# Altium project DA2.PrjPcb (part 1 of 2)
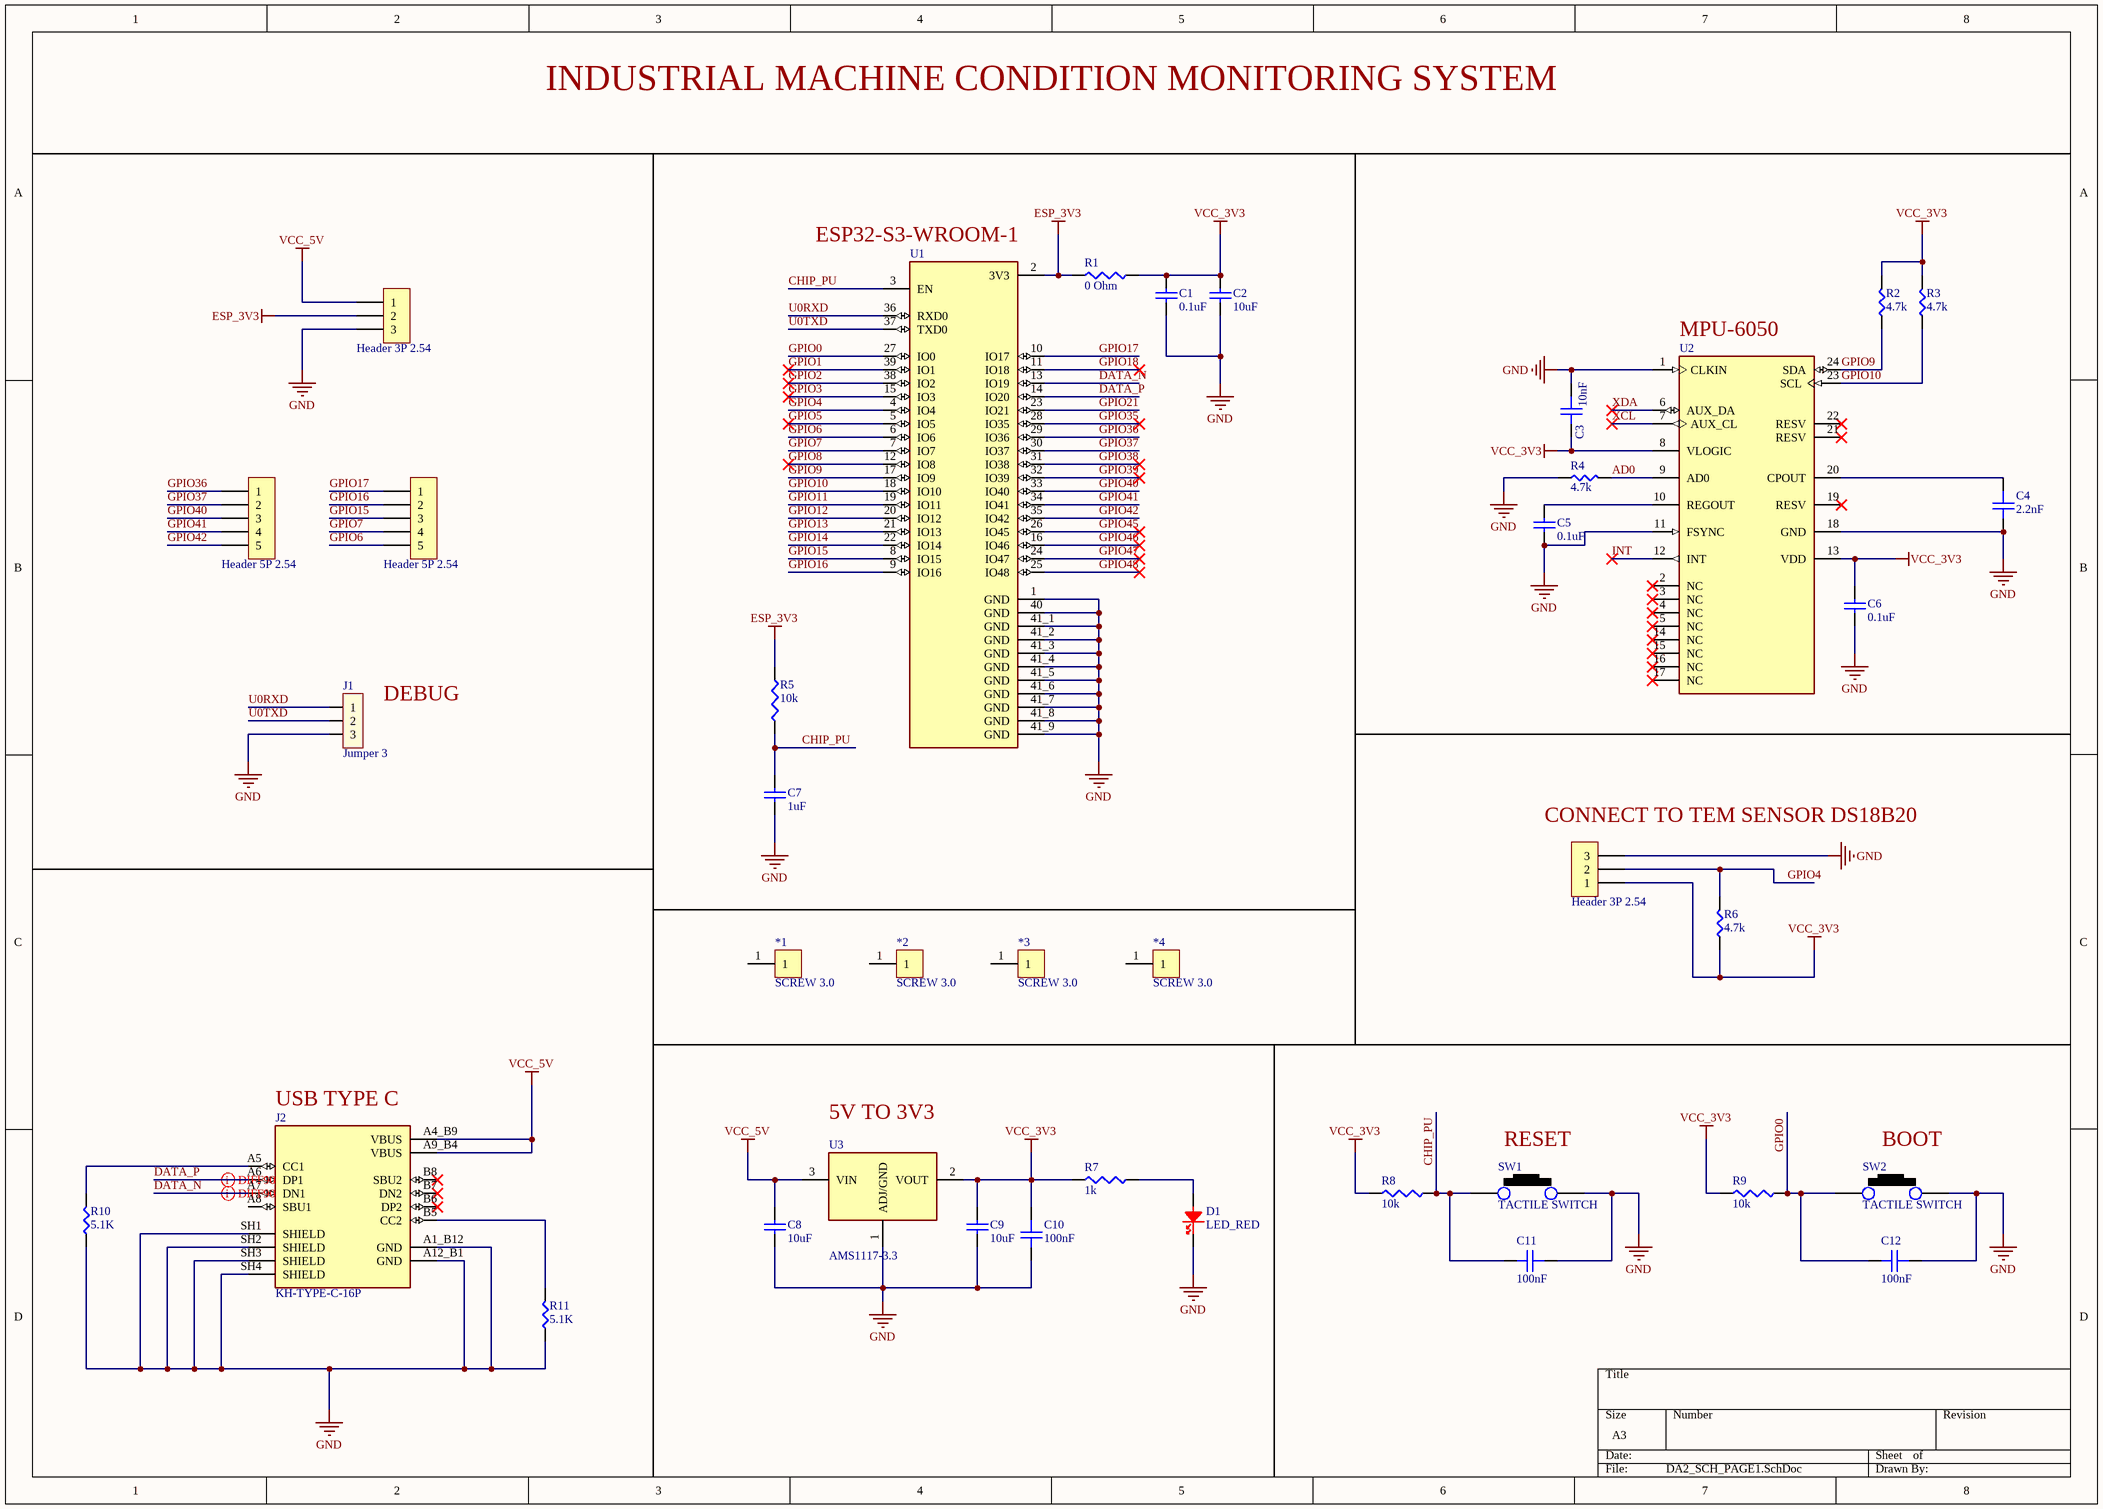
[diagram p0: DA2_SCH_PAGE1.SchDoc]
2 sheets, 68 parts. Net scope: global (net labels, ports and power ports of the same name join across sheets).
Board file: DA2_VERR2_PCB.PcbDoc
Sheets:
  DA2_SCH_PAGE1.SchDoc
  DA2_SCH_PAGE2.SchDoc

## Sheet DA2_SCH_PAGE1.SchDoc
size A3; SheetNumber: 1; SheetTotal: 2

### Parts
*1  SCREW 3.0  [Screw 3.0 v2]
*2  SCREW 3.0  [Screw 3.0 v2]
*3  SCREW 3.0  [Screw 3.0 v2]
*4  SCREW 3.0  [Screw 3.0 v2]
C1  0.1uF  [Tu 0805]
C2  10uF  [Tu 0805]
C3  10nF  [tu 0805]
C4  2.2nF  [tu 0805]
C5  0.1uF  [Tu 0805]
C6  0.1uF  [Tu 0805]
C7  1uF  [Tu 0805]
C8  10uF  [Tu 0805]
C9  10uF  [Tu 0805]
C10  100nF  [tu 0805]
C11  100nF  [tu 0805]
C12  100nF  [tu 0805]
D1  LED_RED  [LED 0805]
H1  Header 3P 2.54  [XH2.54M-3]
H2  Header 5P 2.54  [XH2.54M-5]
H3  Header 5P 2.54  [XH2.54M-5]
H4  Header 3P 2.54  [XH2.54M-3]
J1  Jumper 3  [JP3]
J2  KH-TYPE-C-16P  [KINGHELM_KH-TYPE-C-16P]
R1  0 Ohm  [Tro SMD 0805]
R2  4.7k  [tro smd 0805]
R3  4.7k  [tro smd 0805]
R4  4.7k  [tro smd 0805]
R5  10k  [Tro SMD 0805]
R6  4.7k  [tro smd 0805]
R7  1k  [Tro SMD 0805]
R8  10k  [Tro SMD 0805]
R9  10k  [Tro SMD 0805]
R10  5.1K  [tro smd 0805]
R11  5.1K  [tro smd 0805]
SW1  TACTILE SWITCH  [SWITCH SMD]
SW2  TACTILE SWITCH  [SWITCH SMD]
U1  ESP32-S3-WROOM-1-N8R2  [XCVR_ESP32-S3-WROOM-1-N8R2]  (value not drawn)
U2  MPU-6050  [QFN50P400X400X95-24N]  (value not drawn)
U3  AMS1117-3.3  [SOT229P700X180-4N]

### Nets
ESP_3V3: H1.2 R1.1 R5.2 U1.2(3V3)
GND: C1.1 C2.1 C3.1 C4.2 C5.1 C6.1 C7.1 C8.1 C9.1 C10.2 C11.1 C12.1 D1.1 H1.3 H4.3 J1.3 J2.A1_B12(GND) J2.A12_B1(GND) J2.SH1(SHIELD) J2.SH2(SHIELD) J2.SH3(SHIELD) J2.SH4(SHIELD) R4.1 R10.1 R11.1 SW1.2 SW2.2 U1.1(GND) U1.40(GND) U1.41_1(GND) U1.41_2(GND) U1.41_3(GND) U1.41_4(GND) U1.41_5(GND) U1.41_6(GND) U1.41_7(GND) U1.41_8(GND) U1.41_9(GND) U2.1(CLKIN) U2.11(FSYNC) U2.18(GND) U3.1(ADJ/GND)
VCC_3V3: C1.2 C2.2 C3.2 C6.2 C9.2 C10.1 H4.1 R1.2 R2.2 R3.2 R6.1 R7.1 R8.1 R9.1 U2.8(VLOGIC) U2.13(VDD) U3.2(VOUT)
VCC_5V: C8.2 H1.1 J2.A4_B9(VBUS) J2.A9_B4(VBUS) U3.3(VIN)
AD0: R4.2 U2.9(AD0)
CHIP_PU: C7.2 C11.2 R5.1 R8.2 SW1.1 U1.3(EN)
DATA_N: J2.A7(DN1) U1.13(IO19)
DATA_P: J2.A6(DP1) U1.14(IO20)
GPIO0: C12.2 R9.2 SW2.1 U1.27(IO0)
GPIO1: U1.39(IO1)
GPIO2: U1.38(IO2)
GPIO3: U1.15(IO3)
GPIO4: H4.2 R6.2 U1.4(IO4)
GPIO5: U1.5(IO5)
GPIO6: H3.5 U1.6(IO6)
GPIO7: H3.4 U1.7(IO7)
GPIO8: U1.12(IO8)
GPIO9: R2.1 U1.17(IO9) U2.24(SDA)
GPIO10: R3.1 U1.18(IO10) U2.23(SCL)
GPIO11: U1.19(IO11)
GPIO12: U1.20(IO12)
GPIO13: U1.21(IO13)
GPIO14: U1.22(IO14)
GPIO15: H3.3 U1.8(IO15)
GPIO16: H3.2 U1.9(IO16)
GPIO17: H3.1 U1.10(IO17)
GPIO18: U1.11(IO18)
GPIO21: U1.23(IO21)
GPIO35: U1.28(IO35)
GPIO36: H2.1 U1.29(IO36)
GPIO37: H2.2 U1.30(IO37)
GPIO38: U1.31(IO38)
GPIO39: U1.32(IO39)
GPIO40: H2.3 U1.33(IO40)
GPIO41: H2.4 U1.34(IO41)
GPIO42: H2.5 U1.35(IO42)
GPIO45: U1.26(IO45)
GPIO46: U1.16(IO46)
GPIO47: U1.24(IO47)
GPIO48: U1.25(IO48)
INT: U2.12(INT)
U0RXD: J1.1 U1.36(RXD0)
U0TXD: J1.2 U1.37(TXD0)
XCL: U2.7(AUX_CL)
XDA: U2.6(AUX_DA)
NetC4_1: C4.1 U2.20(CPOUT)
NetC5_2: C5.2 U2.10(REGOUT)
NetD1_2: D1.2 R7.2
NetJ2_A5: J2.A5(CC1) R10.2
NetJ2_B5: J2.B5(CC2) R11.2

Not connected (* = marked no-connect by the designer): *1 1; *2 1; *3 1; *4 1; J2 A8(SBU1) B6(DP2)* B7(DN2)* B8(SBU2)*; U2 2(NC)* 3(NC)* 4(NC)* 5(NC)* 14(NC)* 15(NC)* 16(NC)* 17(NC)* 19(RESV)* 21(RESV)* 22(RESV)*

### Layout directives
differential pair; differential pair class diff90: DATA_N, DATA_P

### Notes on the sheet
- INDUSTRIAL MACHINE CONDITION MONITORING SYSTEM
- (near U1) ESP32-S3-WROOM-1
- (near U2) MPU-6050
- (near J1) DEBUG
- (near H4) CONNECT TO TEM SENSOR DS18B20
- (near J2) USB TYPE C
- 5V TO 3V3
- (near SW1) RESET
- (near SW2) BOOT

### Library data of the parts
C1 C5 C6 = Tu 0.1uF: Dán 0805; Manufacturer: Samsung Electro-Mechanics; Manufacturer Part Number: CL05B104KB5NNWC; Value: 100nF; Dielectric Material: Ceramic; Voltage Rating (DC): 50V; Supplier: DigiKey; Supplier Part Number: 1276-CL05B104KB5NNWCCT-ND; RoHS: Compliant; Category: Ceramic Capacitors; Stock: 89504; Pricing: 1=0.1, 10=0.054, 50=0.037, 100=0.0319, 500=0.02338, 1000=0.02075, 2500=0.018, 5000=0.01634 (USD); China RoHS: Compliant; Lifecycle Status: Production; Max Operating Temperature: 125°C; Min Operating Temperature: -55°C; Mounting Technology: Surface Mount; Number of Terminals: 2; REACH SVHC: Yes; Schedule B: 8532240020, 8532240020|8532240020|8532240020|8532240020|8532240020; ComponentLink1URL: https://datasheet.octopart.com:443/CL05B104KB5NNWC-Samsung-Electro-Mechanics-datasheet-182018729.pdf?src-supplier=IHS; ComponentLink1Description: https://datasheet.octopart.com:443/CL05B104KB5NNWC-Samsung-Electro-Mechanics-datasheet-182018729.pdf?src-supplier=IHS; LCSC Part Number: C7229230
C2 C8 C9 = Tu 10uF: Dán 0805; Manufacturer: Samsung Electro-Mechanics; Manufacturer Part Number: CL05A106MP5NUNC; Value: 10µF; Dielectric: X5R; Dielectric Material: Ceramic; Tolerance: 20%; Voltage Rating: 10V; Supplier: DigiKey; Supplier Part Number: 1276-1450-1-ND; RoHS: Compliant; Category: Ceramic Capacitors; Stock: 2239957; Pricing: 1=0.08, 10=0.038, 50=0.034, 100=0.0296, 500=0.0272, 1000=0.02, 2500=0.01844 (USD); Case/Package: 0402; Case Code (Imperial): 0402; Case Code (Metric): 1005; China RoHS: Compliant; Contact Plating: Tin; Depth: 500µm; Height: 700µm; Lead Free: Lead Free; Length: 1mm; Lifecycle Status: NRND; Material: Ceramic; Max Operating Temperature: 85°C; Min Operating Temperature: -55°C; Mounting Technology: Surface Mount; Number of Terminals: 2; Packaging: Tape and Reel; Radiation Hardening: No; REACH SVHC: Yes; Schedule B: 8532240020, 8532240020|8532240020|8532240020|8532240020|8532240020|8532240020|8532240020|8532240020|8532240020|8532240020|8532240020|8532240020|8532240020|8532240020|8532240020|8532240020|8532240020|8532240020|8532240020|8532240020|8532240020|8532240020|8532240020|85; Termination: Wraparound; Thickness: 711.2µm; Voltage Rating (DC): 10V; Width: 500µm; ComponentLink1URL: https://datasheet.octopart.com:443/CL05A106MP5NUNC-Samsung-Electro-Mechanics-datasheet-182018593.pdf?src-supplier=IHS; ComponentLink1Description: https://datasheet.octopart.com:443/CL05A106MP5NUNC-Samsung-Electro-Mechanics-datasheet-182018593.pdf?src-supplier=IHS; ComponentLink2URL: https://datasheet.octopart.com:443/CL05A106MP5NUNC-Samsung-Electro-Mechanics-datasheet-136031723.pdf?src-supplier=Upverter; ComponentLink2Description: https://datasheet.octopart.com:443/CL05A106MP5NUNC-Samsung-Electro-Mechanics-datasheet-136031723.pdf?src-supplier=Upverter; ComponentLink3URL: https://datasheet.octopart.com:443/CL05A106MP5NUNC-Samsung-Electro-Mechanics-datasheet-110226206.pdf?src-supplier=Future+Electronics; ComponentLink3Description: https://datasheet.octopart.com:443/CL05A106MP5NUNC-Samsung-Electro-Mechanics-datasheet-110226206.pdf?src-supplier=Future+Electronics; ComponentLink4URL: https://datasheet.octopart.com:443/CL05A106MP5NUNC-Samsung-Electro-Mechanics-datasheet-87580039.pdf?src-supplier=Future+Electronics; ComponentLink4Description: https://datasheet.octopart.com:443/CL05A106MP5NUNC-Samsung-Electro-Mechanics-datasheet-87580039.pdf?src-supplier=Future+Electronics; ComponentLink5URL: https://datasheet.octopart.com:443/CL05A106MP5NUNC-Samsung-Electro-Mechanics-datasheet-81461595.pdf?src-supplier=Future+Electronics; ComponentLink5Description: https://datasheet.octopart.com:443/CL05A106MP5NUNC-Samsung-Electro-Mechanics-datasheet-81461595.pdf?src-supplier=Future+Electronics; ComponentLink6URL: https://datasheet.octopart.com:443/CL05A106MP5NUNC-Samsung-datasheet-42280527.pdf?src-supplier=Future+Electronics; ComponentLink6Description: https://datasheet.octopart.com:443/CL05A106MP5NUNC-Samsung-datasheet-42280527.pdf?src-supplier=Future+Electronics; ComponentLink7URL: https://datasheet.octopart.com:443/CL05A106MP5NUNC-Samsung-datasheet-34153002.pdf?src-supplier=Future+Electronics; ComponentLink7Description: https://datasheet.octopart.com:443/CL05A106MP5NUNC-Samsung-datasheet-34153002.pdf?src-supplier=Future+Electronics; ComponentLink8URL: https://datasheet.octopart.com:443/CL05A106MP5NUNC-Samsung-datasheet-25077983.pdf?src-supplier=Future+Electronics; ComponentLink8Description: https://datasheet.octopart.com:443/CL05A106MP5NUNC-Samsung-datasheet-25077983.pdf?src-supplier=Future+Electronics; ComponentLink9URL: https://datasheet.octopart.com:443/CL05A106MP5NUNC-Samsung-Electro-Mechanics-datasheet-149136670.pdf?src-supplier=Future+Electronics; ComponentLink9Description: https://datasheet.octopart.com:443/CL05A106MP5NUNC-Samsung-Electro-Mechanics-datasheet-149136670.pdf?src-supplier=Future+Electronics; ComponentLink10URL: https://datasheet.octopart.com:443/CL05A106MP5NUNC-Samsung-datasheet-8326407.pdf?src-supplier=TME; ComponentLink10Description: https://datasheet.octopart.com:443/CL05A106MP5NUNC-Samsung-datasheet-8326407.pdf?src-supplier=TME; LCSC Part Number: C315248
C3 = Tu 10nF: Dán 0805; Don_Vi: Con; So_Chan: 2; Ten_Linh_Kien: Tụ 0805 22nF 50V 20%; Ma_Hang: MH007857; Chung_Loai: Dán; Kieu_Chan: *
C4 = Tu 2.2nF: Dán 0805; Don_Vi: Con; So_Chan: 2; Ten_Linh_Kien: Tụ 0805 22nF 50V 20%; Ma_Hang: MH007857; Chung_Loai: Dán; Kieu_Chan: *
C7 = Tu 1uF: Dán 0805; Manufacturer: Murata; Manufacturer Part Number: GRM155R6YA105KE11D; Manufacturer Lifecycle Status: IN PRODUCTION; Value: 1µF; Dielectric: X5R; Dielectric Material: Ceramic; Tolerance: 10%; Voltage Rating: 35V; Supplier: DigiKey; Supplier Part Number: 490-10019-1-ND; RoHS: Compliant; Category: Ceramic Capacitors; Stock: 212803; Pricing: 1=0.1, 10=0.048, 50=0.033, 100=0.0284, 500=0.01904, 1000=0.01691, 2500=0.01582, 5000=0.01432 (USD); Case/Package: 0402; Case Code (Imperial): 0402; Case Code (Metric): 1005; Height: 500µm; Length: 1mm; Lifecycle Status: Production; Material: Ceramic; Max Operating Temperature: 85°C; Min Operating Temperature: -55°C; Mounting Technology: Surface Mount; Number of Terminals: 2; Packaging: Tape & Reel (TR); REACH SVHC: Yes; Schedule B: 8532240020, 8532240020|8532240020, 8532240020|8532240020|8532240020, 8532240020|8532240020|8532240020|8532240020; Thickness: 500µm; Voltage Rating (DC): 35V; Width: 500µm; ComponentLink1URL: https://datasheet.octopart.com:443/GRM155R6YA105KE11D-Murata-datasheet-149523044.pdf?src-supplier=Newark; ComponentLink1Description: https://datasheet.octopart.com:443/GRM155R6YA105KE11D-Murata-datasheet-149523044.pdf?src-supplier=Newark; ComponentLink2URL: https://datasheet.octopart.com:443/GRM155R6YA105KE11D-Murata-datasheet-165579666.pdf?src-supplier=TME; ComponentLink2Description: https://datasheet.octopart.com:443/GRM155R6YA105KE11D-Murata-datasheet-165579666.pdf?src-supplier=TME; ComponentLink3URL: https://datasheet.octopart.com:443/GRM155R6YA105KE11D-Murata-datasheet-141266224.pdf?src-supplier=Ciiva; ComponentLink3Description: https://datasheet.octopart.com:443/GRM155R6YA105KE11D-Murata-datasheet-141266224.pdf?src-supplier=Ciiva; ComponentLink4URL: https://datasheet.octopart.com:443/GRM155R6YA105KE11D-Murata-datasheet-140690670.pdf?src-supplier=Ciiva; ComponentLink4Description: https://datasheet.octopart.com:443/GRM155R6YA105KE11D-Murata-datasheet-140690670.pdf?src-supplier=Ciiva; ComponentLink5URL: https://datasheet.octopart.com:443/GRM155R6YA105KE11D-Murata-datasheet-138740836.pdf?src-supplier=Ciiva; ComponentLink5Description: https://datasheet.octopart.com:443/GRM155R6YA105KE11D-Murata-datasheet-138740836.pdf?src-supplier=Ciiva; ComponentLink6URL: https://datasheet.octopart.com:443/GRM155R6YA105KE11D-Murata-datasheet-22122223.pdf?src-supplier=Future+Electronics; ComponentLink6Description: https://datasheet.octopart.com:443/GRM155R6YA105KE11D-Murata-datasheet-22122223.pdf?src-supplier=Future+Electronics; ComponentLink7URL: https://datasheet.octopart.com/GRM155R6YA105KE11D-Murata-datasheet-12515295.pdf; ComponentLink7Description: https://datasheet.octopart.com/GRM155R6YA105KE11D-Murata-datasheet-12515295.pdf; ComponentLink8URL: https://datasheet.octopart.com/GRM155R6YA105KE11D-Murata-datasheet-12510076.pdf; ComponentLink8Description: https://datasheet.octopart.com/GRM155R6YA105KE11D-Murata-datasheet-12510076.pdf; ComponentLink9URL: https://datasheet.octopart.com/GRM155R6YA105KE11D-Murata-datasheet-11978611.pdf; ComponentLink9Description: https://datasheet.octopart.com/GRM155R6YA105KE11D-Murata-datasheet-11978611.pdf; ComponentLink10URL: https://datasheet.octopart.com/GRM155R6YA105KE11D-Murata-datasheet-10025737.pdf; ComponentLink10Description: https://datasheet.octopart.com/GRM155R6YA105KE11D-Murata-datasheet-10025737.pdf; ComponentLink11URL: https://datasheet.octopart.com/GRM155R6YA105KE11D-Murata-datasheet-8819587.pdf; ComponentLink11Description: https://datasheet.octopart.com/GRM155R6YA105KE11D-Murata-datasheet-8819587.pdf; ComponentLink12URL: https://datasheet.octopart.com/GRM155R6YA105KE11D-Murata-datasheet-38882776.pdf; ComponentLink12Description: https://datasheet.octopart.com/GRM155R6YA105KE11D-Murata-datasheet-38882776.pdf; ComponentLink13URL: http://sigma.octopart.com:80/reach_statement/Murata-company-16.pdf?src-supplier=Compliance+Statements; ComponentLink13Description: http://sigma.octopart.com:80/reach_statement/Murata-company-16.pdf?src-supplier=Compliance+Statements; LCSC Part Number: C361059
C10-C12 = Tu 100nF: Dán 0805; Don_Vi: Con; So_Chan: 2; Ten_Linh_Kien: Tụ 0805 22nF 50V 20%; Ma_Hang: MH007857; Chung_Loai: Dán; Kieu_Chan: *
D1 = VLMS1500-GS08: LED RED 0402 SMD; Manufacturer: Vishay; Dominant Wavelength: 631nm; Forward Current: 30mA; Forward Voltage: 2.4V; Lens Style: Rectangular, Square; Luminous Intensity: 18mcd; Number of Circuits: 1; Power Rating: 75mW; Reverse Voltage: 5V; Shape: Rectangular; Test Current: 20mA; Viewing Angle: 130°; Supplier: DigiKey; Supplier Part Number: VLMS1500-GS08DKR-ND; Manufacturer Part Number: VLMS1500-GS08; RoHS: Compliant; Category: LEDs; Pricing: 1=0.24, 10=0.164, 100=0.1147, 500=0.09218, 1000=0.0847 (USD); Case/Package: 0402; Case Code (Imperial): 0402; Case Code (Metric): 1005; Color: Red; Height: 350µm; Illumination Color: Red; Lead Free: Lead Free; Length: 1mm; Lifecycle Status: Production; Max Operating Temperature: 85°C; Min Operating Temperature: -30°C; Mounting Technology: Surface Mount; Number of LEDs: 1; Pins: 2; Number of Terminals: 2; Packaging: Cut Tape; Peak Wavelength: 631nm; Radiation Hardening: No; REACH SVHC: Yes; Schedule B: 8541402000, 8541402000|8541402000|8541402000|8541402000|8541402000; Terminal Pitch: 675µm; Wavelength: 631nm; Width: 500µm; ComponentLink1URL: https://datasheet.octopart.com:443/VLMS1500-GS08-Vishay-datasheet-181477802.pdf?src-supplier=IHS; ComponentLink1Description: https://datasheet.octopart.com:443/VLMS1500-GS08-Vishay-datasheet-181477802.pdf?src-supplier=IHS; ComponentLink2URL: https://datasheet.octopart.com:443/VLMS1500-GS08-Vishay-datasheet-21227148.pdf?src-supplier=Future+Electronics; ComponentLink2Description: https://datasheet.octopart.com:443/VLMS1500-GS08-Vishay-datasheet-21227148.pdf?src-supplier=Future+Electronics; ComponentLink3URL: https://datasheet.octopart.com:443/VLMS1500-GS08-Vishay-datasheet-102762782.pdf?src-supplier=Future+Electronics; ComponentLink3Description: https://datasheet.octopart.com:443/VLMS1500-GS08-Vishay-datasheet-102762782.pdf?src-supplier=Future+Electronics; ComponentLink4URL: https://datasheet.octopart.com:443/VLMS1500-GS08-Vishay-datasheet-33014519.pdf?src-supplier=element14+APAC; ComponentLink4Description: https://datasheet.octopart.com:443/VLMS1500-GS08-Vishay-datasheet-33014519.pdf?src-supplier=element14+APAC; ComponentLink5URL: https://datasheet.octopart.com:443/VLMS1500-GS08-Vishay-datasheet-68326145.pdf?src-supplier=TME; ComponentLink5Description: https://datasheet.octopart.com:443/VLMS1500-GS08-Vishay-datasheet-68326145.pdf?src-supplier=TME; ComponentLink6URL: https://datasheet.octopart.com:443/VLMS1500-GS08-Vishay-Siliconix-datasheet-62309867.pdf?src-supplier=RS+(Formerly+Allied+Electronics); ComponentLink6Description: https://datasheet.octopart.com:443/VLMS1500-GS08-Vishay-Siliconix-datasheet-62309867.pdf?src-supplier=RS+(Formerly+Allied+Electronics); ComponentLink7URL: https://datasheet.octopart.com:443/VLMS1500-GS08-Vishay-datasheet-62332426.pdf?src-supplier=Newark; ComponentLink7Description: https://datasheet.octopart.com:443/VLMS1500-GS08-Vishay-datasheet-62332426.pdf?src-supplier=Newark; ComponentLink8URL: https://datasheet.octopart.com/VLMS1500-GS08-Vishay-datasheet-16093911.pdf; ComponentLink8Description: https://datasheet.octopart.com/VLMS1500-GS08-Vishay-datasheet-16093911.pdf; ComponentLink9URL: http://sigma.octopart.com:80/rohs_statement/Vishay-company-15.pdf?src-supplier=Compliance+Statements; ComponentLink9Description: http://sigma.octopart.com:80/rohs_statement/Vishay-company-15.pdf?src-supplier=Compliance+Statements; LCSC Part Number: C511370
H1 H4 = Header 3P 2.54 Duc Thang: Cắm; Ten_Linh_Kien: Header 3P XH2.54-3P Đực Thẳng; Don_Vi: Con; Ma_Hang: MH001292; Chung_Loai: Cắm
H2 H3 = Header 5P 2.54 Duc Thang: Cắm; Ten_Linh_Kien: Header 5P XH2.54-5P Đực Thẳng; Don_Vi: Con; Ma_Hang: MH001298; Chung_Loai: Cắm
J1 = JP3: Value: J3
J2 = KH-TYPE-C-16P: MF: kinghelm; SnapEDA_Link: https://www.snapeda.com/parts/KH-TYPE-C-16P/Kinghelm/view-part/?ref=snap; Package: None; Value: *; MP: KH-TYPE-C-16P; Check_prices: https://www.snapeda.com/parts/KH-TYPE-C-16P/Kinghelm/view-part/?ref=eda
R1 = Tro 0Ohm: Dán 0805; Manufacturer: Yageo Group; Manufacturer Part Number: RC0402JR-070RL; Max Power Dissipation: 63mW; Power Dissipation: 62.5mW; Value: 0Ω; Temperature Coefficient: 200ppm/°C; Tolerance: 5%; Voltage Rating: 50V; Supplier: DigiKey; Supplier Part Number: 311-0.0JRCT-ND; RoHS: Compliant; Category: Chip SMD Resistors; Stock: 23498418; Pricing: 1=0.1, 10=0.010, 25=0.0064, 50=0.0054, 100=0.0047, 250=0.00392, 500=0.00346, 1000=0.00304, 5000=0.0023, 10000=0.00206, 20000=0.00185, 30000=0.00175, 50000=0.00163, 70000=0.00155, 100000=0.00148, 120000=0.00145, 240000=0.00134, 250000=0.00133 (USD); Case/Package: 0402; Case Code (Imperial): 0402; China RoHS: Non-Compliant; Composition: Thick Film; Contact Plating: Tin; Depth: 500µm; Features: Moisture Resistant; Height: 350µm; Lead Free: Lead Free; Length: 1mm; Lifecycle Status: Production; Max Operating Temperature: 155°C; Military Standard: Not; Min Operating Temperature: -55°C; Mounting Technology: Surface Mount; Pins: 2; Number of Terminals: 2; Number of Terminations: 2; Packaging: Tape & Reel; Power Rating: 63mW; Radiation Hardening: No; REACH SVHC: Yes; Schedule B: 8533290000, 8533290000|8533290000, 8533290000|8533290000|8533290000, 8533290000|8533290000|8533290000|8533290000; Termination: SMD/SMT; Voltage Rating (DC): 50V; Width: 500µm; ComponentLink1URL: https://datasheet.octopart.com:443/RC0402JR-070RL-Yageo-datasheet-182189538.pdf?src-supplier=IHS; ComponentLink1Description: https://datasheet.octopart.com:443/RC0402JR-070RL-Yageo-datasheet-182189538.pdf?src-supplier=IHS; ComponentLink2URL: https://datasheet.octopart.com:443/RC0402JR-070RL-Yageo-datasheet-10408619.pdf?src-supplier=Newark; ComponentLink2Description: https://datasheet.octopart.com:443/RC0402JR-070RL-Yageo-datasheet-10408619.pdf?src-supplier=Newark; ComponentLink3URL: https://datasheet.octopart.com:443/RC0402JR-070RL-Yageo-datasheet-12531192.pdf?src-supplier=Seeed+Studio; ComponentLink3Description: https://datasheet.octopart.com:443/RC0402JR-070RL-Yageo-datasheet-12531192.pdf?src-supplier=Seeed+Studio; ComponentLink4URL: https://datasheet.octopart.com:443/RC0402JR-070RL-Yageo-datasheet-8324527.pdf?src-supplier=TME; ComponentLink4Description: https://datasheet.octopart.com:443/RC0402JR-070RL-Yageo-datasheet-8324527.pdf?src-supplier=TME; ComponentLink5URL: https://datasheet.octopart.com:443/RC0402JR-070RL-Yageo-datasheet-62067350.pdf?src-supplier=Farnell; ComponentLink5Description: https://datasheet.octopart.com:443/RC0402JR-070RL-Yageo-datasheet-62067350.pdf?src-supplier=Farnell; ComponentLink6URL: https://datasheet.octopart.com:443/RC0402JR-070RL-Yageo-datasheet-8329306.pdf?src-supplier=element14; ComponentLink6Description: https://datasheet.octopart.com:443/RC0402JR-070RL-Yageo-datasheet-8329306.pdf?src-supplier=element14; ComponentLink7URL: https://datasheet.octopart.com:443/RC0402JR-070RL-Yageo-datasheet-505231.pdf?src-supplier=element14; ComponentLink7Description: https://datasheet.octopart.com:443/RC0402JR-070RL-Yageo-datasheet-505231.pdf?src-supplier=element14; ComponentLink8URL: https://datasheet.octopart.com:443/RC0402JR-070RL-Yageo-datasheet-175423674.pdf?src-supplier=SOS+electronic; ComponentLink8Description: https://datasheet.octopart.com:443/RC0402JR-070RL-Yageo-datasheet-175423674.pdf?src-supplier=SOS+electronic; ComponentLink9URL: https://datasheet.octopart.com:443/RC0402JR-070RL-Yageo-datasheet-164759695.pdf?src-supplier=Future+Electronics; ComponentLink9Description: https://datasheet.octopart.com:443/RC0402JR-070RL-Yageo-datasheet-164759695.pdf?src-supplier=Future+Electronics; ComponentLink10URL: https://datasheet.octopart.com:443/RC0402JR-070RL-Yageo-datasheet-137700087.pdf?src-supplier=Future+Electronics; ComponentLink10Description: https://datasheet.octopart.com:443/RC0402JR-070RL-Yageo-datasheet-137700087.pdf?src-supplier=Future+Electronics; ComponentLink11URL: https://datasheet.octopart.com/RC0402JR-070RL-Yageo-datasheet-73766026.pdf; ComponentLink11Description: https://datasheet.octopart.com/RC0402JR-070RL-Yageo-datasheet-73766026.pdf; ComponentLink12URL: http://sigma.octopart.com:80/rohs_statement/Yageo-company-2.pdf?src-supplier=Compliance+Statements; ComponentLink12Description: http://sigma.octopart.com:80/rohs_statement/Yageo-company-2.pdf?src-supplier=Compliance+Statements; ComponentLink13URL: http://sigma.octopart.com:80/conflict_mineral_statement/Yageo-company-3.pdf?src-supplier=Compliance+Statements; ComponentLink13Description: http://sigma.octopart.com:80/conflict_mineral_statement/Yageo-company-3.pdf?src-supplier=Compliance+Statements; LCSC Part Number: C60485
R2-R4 R6 = Tro 4.7k: Dán 0805; Don_Vi: Con; So_Chan: 2; Ten_Linh_Kien: Trở 0805 5% 4.7k; Ma_Hang: MH005307; Chung_Loai: Dán; Kieu_Chan: *
R5 R8 R9 = Tro 10k: Dán 0805; Manufacturer: Yageo Group; Manufacturer Part Number: RC0402FR-0710KL; Power Dissipation: 62.5mW; Power Rating: 63mW; Value: 10kΩ; Temperature Coefficient: 100ppm/°C; Tolerance: 1%; Voltage Rating: 50V; Supplier: DigiKey; Supplier Part Number: 311-10.0KLRCT-ND; RoHS: Compliant; Category: Chip SMD Resistors; Stock: 10693324; Pricing: 1=0.11, 10=0.011, 25=0.010, 50=0.0092, 100=0.0071, 250=0.00308, 10000=0.00286, 20000=0.00253, 30000=0.00237, 50000=0.0022, 70000=0.0021, 100000=0.002, 120000=0.00196, 240000=0.00182, 250000=0.00181 (USD); Case/Package: 0402; Case Code (Imperial): 0402; Case Code (Metric): 0402; China RoHS: Non-Compliant; Composition: Thick Film; Depth: 500µm; Height: 350µm; Lead Free: Lead Free; Lead Pitch: 200µm; Length: 1mm; Lifecycle Status: Production; Max Operating Temperature: 155°C; Military Standard: Not; Min Operating Temperature: -55°C; Mounting Technology: Surface Mount; Pins: 2; Number of Terminals: 2; Number of Terminations: 2; Packaging: Tape & Reel; REACH SVHC: Yes; Schedule B: 8533210045, 8533210045|8533210045|8533210045|8533210045|8533210045|8533210045|8533210045|8533210045|8533210045|8533210045|8533210045|8533210045|8533210045|8533210045, 8533210045|8533210045|8533210045|8533210045|8533210045|8533210045|8533210045|8533210045|8533210045|8533210045|8533210045|8533210045|8533210045|8533210045|8533210045, 8533210045|8533210045|8533210045|8533210045|8533210045|8533210045|8533210045|8533210045|8533210045|8533210045|8533210045|8533210045|8533210045|8533210045|8533210045|8533210045; Termination: SMD/SMT; Voltage Rating (DC): 50V; Width: 500µm; Working Voltage: 50V; ComponentLink1URL: https://datasheet.octopart.com:443/RC0402FR-0710KL-Yageo-datasheet-175887523.pdf?src-supplier=Newark; ComponentLink1Description: https://datasheet.octopart.com:443/RC0402FR-0710KL-Yageo-datasheet-175887523.pdf?src-supplier=Newark; ComponentLink2URL: https://datasheet.octopart.com:443/RC0402FR-0710KL-Yageo-datasheet-12531192.pdf?src-supplier=Newark; ComponentLink2Description: https://datasheet.octopart.com:443/RC0402FR-0710KL-Yageo-datasheet-12531192.pdf?src-supplier=Newark; ComponentLink3URL: https://datasheet.octopart.com:443/RC0402FR-0710KL-Yageo-datasheet-8324527.pdf?src-supplier=Newark; ComponentLink3Description: https://datasheet.octopart.com:443/RC0402FR-0710KL-Yageo-datasheet-8324527.pdf?src-supplier=Newark; ComponentLink4URL: https://datasheet.octopart.com:443/RC0402FR-0710KL-Yageo-datasheet-10408619.pdf?src-supplier=element14+APAC; ComponentLink4Description: https://datasheet.octopart.com:443/RC0402FR-0710KL-Yageo-datasheet-10408619.pdf?src-supplier=element14+APAC; ComponentLink5URL: https://datasheet.octopart.com:443/RC0402FR-0710KL-Yageo-datasheet-62067350.pdf?src-supplier=element14+APAC; ComponentLink5Description: https://datasheet.octopart.com:443/RC0402FR-0710KL-Yageo-datasheet-62067350.pdf?src-supplier=element14+APAC; ComponentLink6URL: https://datasheet.octopart.com:443/RC0402FR-0710KL-Yageo-datasheet-21426659.pdf?src-supplier=element14+APAC; ComponentLink6Description: https://datasheet.octopart.com:443/RC0402FR-0710KL-Yageo-datasheet-21426659.pdf?src-supplier=element14+APAC; ComponentLink7URL: https://datasheet.octopart.com:443/RC0402FR-0710KL-Yageo-datasheet-164759695.pdf?src-supplier=Upverter; ComponentLink7Description: https://datasheet.octopart.com:443/RC0402FR-0710KL-Yageo-datasheet-164759695.pdf?src-supplier=Upverter; ComponentLink8URL: https://datasheet.octopart.com:443/RC0402FR-0710KL-Yageo-datasheet-103092701.pdf?src-supplier=Upverter; ComponentLink8Description: https://datasheet.octopart.com:443/RC0402FR-0710KL-Yageo-datasheet-103092701.pdf?src-supplier=Upverter; ComponentLink9URL: https://sigma.octopart.com:443/138820526/technical_drawing/Yageo-RC0402FR-0710KL.pdf?src-supplier=Upverter; ComponentLink9Description: https://sigma.octopart.com:443/138820526/technical_drawing/Yageo-RC0402FR-0710KL.pdf?src-supplier=Upverter; ComponentLink10URL: https://datasheet.octopart.com:443/RC0402FR-0710KL-Yageo-datasheet-98239111.pdf?src-supplier=Upverter; ComponentLink10Description: https://datasheet.octopart.com:443/RC0402FR-0710KL-Yageo-datasheet-98239111.pdf?src-supplier=Upverter; ComponentLink11URL: https://datasheet.octopart.com:443/RC0402FR-0710KL-Yageo-datasheet-68298067.pdf?src-supplier=Upverter; ComponentLink11Description: https://datasheet.octopart.com:443/RC0402FR-0710KL-Yageo-datasheet-68298067.pdf?src-supplier=Upverter; ComponentLink12URL: https://datasheet.octopart.com:443/RC0402FR-0710KL-Yageo-datasheet-68297981.pdf?src-supplier=Upverter; ComponentLink12Description: https://datasheet.octopart.com:443/RC0402FR-0710KL-Yageo-datasheet-68297981.pdf?src-supplier=Upverter; ComponentLink13URL: https://datasheet.octopart.com:443/RC0402FR-0710KL-Yageo-datasheet-141435361.pdf?src-supplier=Upverter; ComponentLink13Description: https://datasheet.octopart.com:443/RC0402FR-0710KL-Yageo-datasheet-141435361.pdf?src-supplier=Upverter; ComponentLink14URL: https://datasheet.octopart.com:443/RC0402FR-0710KL-Yageo-datasheet-12509768.pdf?src-supplier=Upverter; ComponentLink14Description: https://datasheet.octopart.com:443/RC0402FR-0710KL-Yageo-datasheet-12509768.pdf?src-supplier=Upverter; ComponentLink15URL: https://datasheet.octopart.com:443/RC0402FR-0710KL-Yageo-datasheet-8329306.pdf?src-supplier=element14; ComponentLink15Description: https://datasheet.octopart.com:443/RC0402FR-0710KL-Yageo-datasheet-8329306.pdf?src-supplier=element14; ComponentLink16URL: https://datasheet.octopart.com:443/RC0402FR-0710KL-Yageo-datasheet-505231.pdf?src-supplier=element14; ComponentLink16Description: https://datasheet.octopart.com:443/RC0402FR-0710KL-Yageo-datasheet-505231.pdf?src-supplier=element14; ComponentLink17URL: https://datasheet.octopart.com:443/RC0402FR-0710KL-Yageo-datasheet-175423674.pdf?src-supplier=SOS+electronic; ComponentLink17Description: https://datasheet.octopart.com:443/RC0402FR-0710KL-Yageo-datasheet-175423674.pdf?src-supplier=SOS+electronic; ComponentLink18URL: https://datasheet.octopart.com:443/RC0402FR-0710KL-Yageo-datasheet-137700087.pdf?src-supplier=Future+Electronics; ComponentLink18Description: https://datasheet.octopart.com:443/RC0402FR-0710KL-Yageo-datasheet-137700087.pdf?src-supplier=Future+Electronics; ComponentLink19URL: https://datasheet.octopart.com:443/RC0402FR-0710KL-Yageo-datasheet-8324255.pdf?src-supplier=Future+Electronics; ComponentLink19Description: https://datasheet.octopart.com:443/RC0402FR-0710KL-Yageo-datasheet-8324255.pdf?src-supplier=Future+Electronics; ComponentLink20URL: https://datasheet.octopart.com:443/RC0402FR-0710KL-Yageo-datasheet-79472498.pdf?src-supplier=Megastar; ComponentLink20Description: https://datasheet.octopart.com:443/RC0402FR-0710KL-Yageo-datasheet-79472498.pdf?src-supplier=Megastar; ComponentLink21URL: https://datasheet.octopart.com/RC0402FR-0710KL-Yageo-datasheet-73766026.pdf; ComponentLink21Description: https://datasheet.octopart.com/RC0402FR-0710KL-Yageo-datasheet-73766026.pdf; ComponentLink22URL: http://sigma.octopart.com:80/rohs_statement/Yageo-company-2.pdf?src-supplier=Compliance+Statements; ComponentLink22Description: http://sigma.octopart.com:80/rohs_statement/Yageo-company-2.pdf?src-supplier=Compliance+Statements; ComponentLink23URL: http://sigma.octopart.com:80/conflict_mineral_statement/Yageo-company-3.pdf?src-supplier=Compliance+Statements; ComponentLink23Description: http://sigma.octopart.com:80/conflict_mineral_statement/Yageo-company-3.pdf?src-supplier=Compliance+Statements; LCSC Part Number: C60490
R7 = Tro 1k: Dán 0805; Manufacturer: Yageo Group; Manufacturer Part Number: RC0402JR-071KL; Max Power Dissipation: 63mW; Power Dissipation: 62.5mW; Value: 1kΩ; Temperature Coefficient: 100ppm/°C; Tolerance: 5%; Voltage Rating: 50V; Supplier: DigiKey; Supplier Part Number: 311-1.0KJRCT-ND; RoHS: Compliant; Category: Chip SMD Resistors; Stock: 6533264; Pricing: 1=0.1, 10=0.006, 25=0.0052, 50=0.004, 100=0.0036, 250=0.00284 (USD); Case/Package: 0402; Case Code (Imperial): 0402; China RoHS: Non-Compliant; Composition: Thick Film; Depth: 500µm; Features: Moisture Resistant; Height: 350µm; Lead Free: Lead Free; Length: 1mm; Lifecycle Status: Production; Max Operating Temperature: 155°C; Military Standard: Not; Min Operating Temperature: -55°C; Mounting Technology: Surface Mount; Pins: 2; Number of Terminals: 2; Number of Terminations: 2; Packaging: Tape & Reel; Power Rating: 62.5mW; REACH SVHC: Yes; Schedule B: 8533210045, 8533210045|8533210045, 8533210045|8533210045|8533210045, 8533210045|8533210045|8533210045|8533210045; Termination: SMD/SMT; Voltage Rating (AC): 50V; Voltage Rating (DC): 50V; Width: 500µm; Working Voltage: 50V; ComponentLink1URL: https://datasheet.octopart.com:443/RC0402JR-071KL-Yageo-datasheet-175887523.pdf?src-supplier=Farnell; ComponentLink1Description: https://datasheet.octopart.com:443/RC0402JR-071KL-Yageo-datasheet-175887523.pdf?src-supplier=Farnell; ComponentLink2URL: https://datasheet.octopart.com:443/RC0402JR-071KL-Yageo-datasheet-8324527.pdf?src-supplier=Farnell; ComponentLink2Description: https://datasheet.octopart.com:443/RC0402JR-071KL-Yageo-datasheet-8324527.pdf?src-supplier=Farnell; ComponentLink3URL: https://datasheet.octopart.com:443/RC0402JR-071KL-Yageo-datasheet-10408619.pdf?src-supplier=Newark; ComponentLink3Description: https://datasheet.octopart.com:443/RC0402JR-071KL-Yageo-datasheet-10408619.pdf?src-supplier=Newark; ComponentLink4URL: https://datasheet.octopart.com:443/RC0402JR-071KL-Yageo-datasheet-505231.pdf?src-supplier=Newark; ComponentLink4Description: https://datasheet.octopart.com:443/RC0402JR-071KL-Yageo-datasheet-505231.pdf?src-supplier=Newark; ComponentLink5URL: https://datasheet.octopart.com:443/RC0402JR-071KL-Yageo-datasheet-79472498.pdf?src-supplier=Upverter; ComponentLink5Description: https://datasheet.octopart.com:443/RC0402JR-071KL-Yageo-datasheet-79472498.pdf?src-supplier=Upverter; ComponentLink6URL: https://datasheet.octopart.com:443/RC0402JR-071KL-Yageo-datasheet-44585784.pdf?src-supplier=Upverter; ComponentLink6Description: https://datasheet.octopart.com:443/RC0402JR-071KL-Yageo-datasheet-44585784.pdf?src-supplier=Upverter; ComponentLink7URL: https://datasheet.octopart.com:443/RC0402JR-071KL-Yageo-datasheet-62067350.pdf?src-supplier=element14+APAC; ComponentLink7Description: https://datasheet.octopart.com:443/RC0402JR-071KL-Yageo-datasheet-62067350.pdf?src-supplier=element14+APAC; ComponentLink8URL: https://datasheet.octopart.com:443/RC0402JR-071KL-Yageo-datasheet-148775077.pdf?src-supplier=JRH+Electronics; ComponentLink8Description: https://datasheet.octopart.com:443/RC0402JR-071KL-Yageo-datasheet-148775077.pdf?src-supplier=JRH+Electronics; ComponentLink9URL: https://datasheet.octopart.com:443/RC0402JR-071KL-Yageo-datasheet-12531192.pdf?src-supplier=Seeed+Studio; ComponentLink9Description: https://datasheet.octopart.com:443/RC0402JR-071KL-Yageo-datasheet-12531192.pdf?src-supplier=Seeed+Studio; ComponentLink10URL: https://datasheet.octopart.com:443/RC0402JR-071KL-Yageo-datasheet-164759695.pdf?src-supplier=Future+Electronics; ComponentLink10Description: https://datasheet.octopart.com:443/RC0402JR-071KL-Yageo-datasheet-164759695.pdf?src-supplier=Future+Electronics; ComponentLink11URL: https://datasheet.octopart.com:443/RC0402JR-071KL-Yageo-datasheet-137700087.pdf?src-supplier=Future+Electronics; ComponentLink11Description: https://datasheet.octopart.com:443/RC0402JR-071KL-Yageo-datasheet-137700087.pdf?src-supplier=Future+Electronics; ComponentLink12URL: https://datasheet.octopart.com/RC0402JR-071KL-Yageo-datasheet-73766026.pdf; ComponentLink12Description: https://datasheet.octopart.com/RC0402JR-071KL-Yageo-datasheet-73766026.pdf; ComponentLink13URL: https://datasheet.octopart.com:443/RC0402JR-071KL-Yageo-datasheet-8329306.pdf?src-supplier=element14; ComponentLink13Description: https://datasheet.octopart.com:443/RC0402JR-071KL-Yageo-datasheet-8329306.pdf?src-supplier=element14; ComponentLink14URL: http://sigma.octopart.com:80/rohs_statement/Yageo-company-2.pdf?src-supplier=Compliance+Statements; ComponentLink14Description: http://sigma.octopart.com:80/rohs_statement/Yageo-company-2.pdf?src-supplier=Compliance+Statements; ComponentLink15URL: http://sigma.octopart.com:80/conflict_mineral_statement/Yageo-company-3.pdf?src-supplier=Compliance+Statements; ComponentLink15Description: http://sigma.octopart.com:80/conflict_mineral_statement/Yageo-company-3.pdf?src-supplier=Compliance+Statements; LCSC Part Number: C105637
R10 R11 = Tro 5.1K: Dán 0805; Don_Vi: Con; So_Chan: 2; Ten_Linh_Kien: Trở 0805 1% 49.9R; Ma_Hang: MH005480; Chung_Loai: Dán; Kieu_Chan: *
SW1 SW2 = SW1_RS-282G05A3-SMRT-SMD: Tactile Switch SPST-NO Top Actuated Surface Mount; Manufacturer: ITT C&K; Alternate Part Number-1: NA; Manufacturer Part Number: RS-282G05A3-SMRT; Case/Package: SMD; Supplier-1: SP ROAD; Supplier Part Number-1: RS-282G05A3-SMRT
U1 = ESP32-S3-WROOM-1-N8R2: WiFi 802.11a/b/g/n, Bluetooth v5.0 Transceiver Module 2.4GHz Antenna Not Included -; MF: Espressif Systems; Package: - Espressif Systems; Price: None; Check_prices: https://www.snapeda.com/parts/ESP32-S3-WROOM-1-N8R2/Espressif+Systems/view-part/?ref=eda; Value: *; SnapEDA_Link: https://www.snapeda.com/parts/ESP32-S3-WROOM-1-N8R2/Espressif+Systems/view-part/?ref=snap; MP: ESP32-S3-WROOM-1-N8R2; Availability: In Stock; Purchase-URL: https://pricing.snapeda.com/search?q=ESP32-S3-WROOM-1-N8R2&ref=eda
U2 = MPU-6050: MPU-6050 series Accelerometer, Gyroscope, 3 Axis Sensor Evaluation Board; MF: TDK InvenSense; SnapEDA_Link: https://www.snapeda.com/parts/MPU-6050/TDK+InvenSense/view-part/?ref=snap; Package: QFN-24 InvenSense; Value: *; MP: MPU-6050; Check_prices: https://www.snapeda.com/parts/MPU-6050/TDK+InvenSense/view-part/?ref=eda
U3 = AMS1117-3.3: Linear Voltage Regulator IC Positive Fixed 1 Output 1A SOT-223-3L; MF: UMW; SnapEDA_Link: https://www.snapeda.com/parts/AMS1117-3.3/UMW/view-part/?ref=snap; Package: SOT-223-3L UMW; Value: *; MP: AMS1117-3.3; Check_prices: https://www.snapeda.com/parts/AMS1117-3.3/UMW/view-part/?ref=eda